# Altium project Motion_Controller.PrjPCB (part 1 of 4)
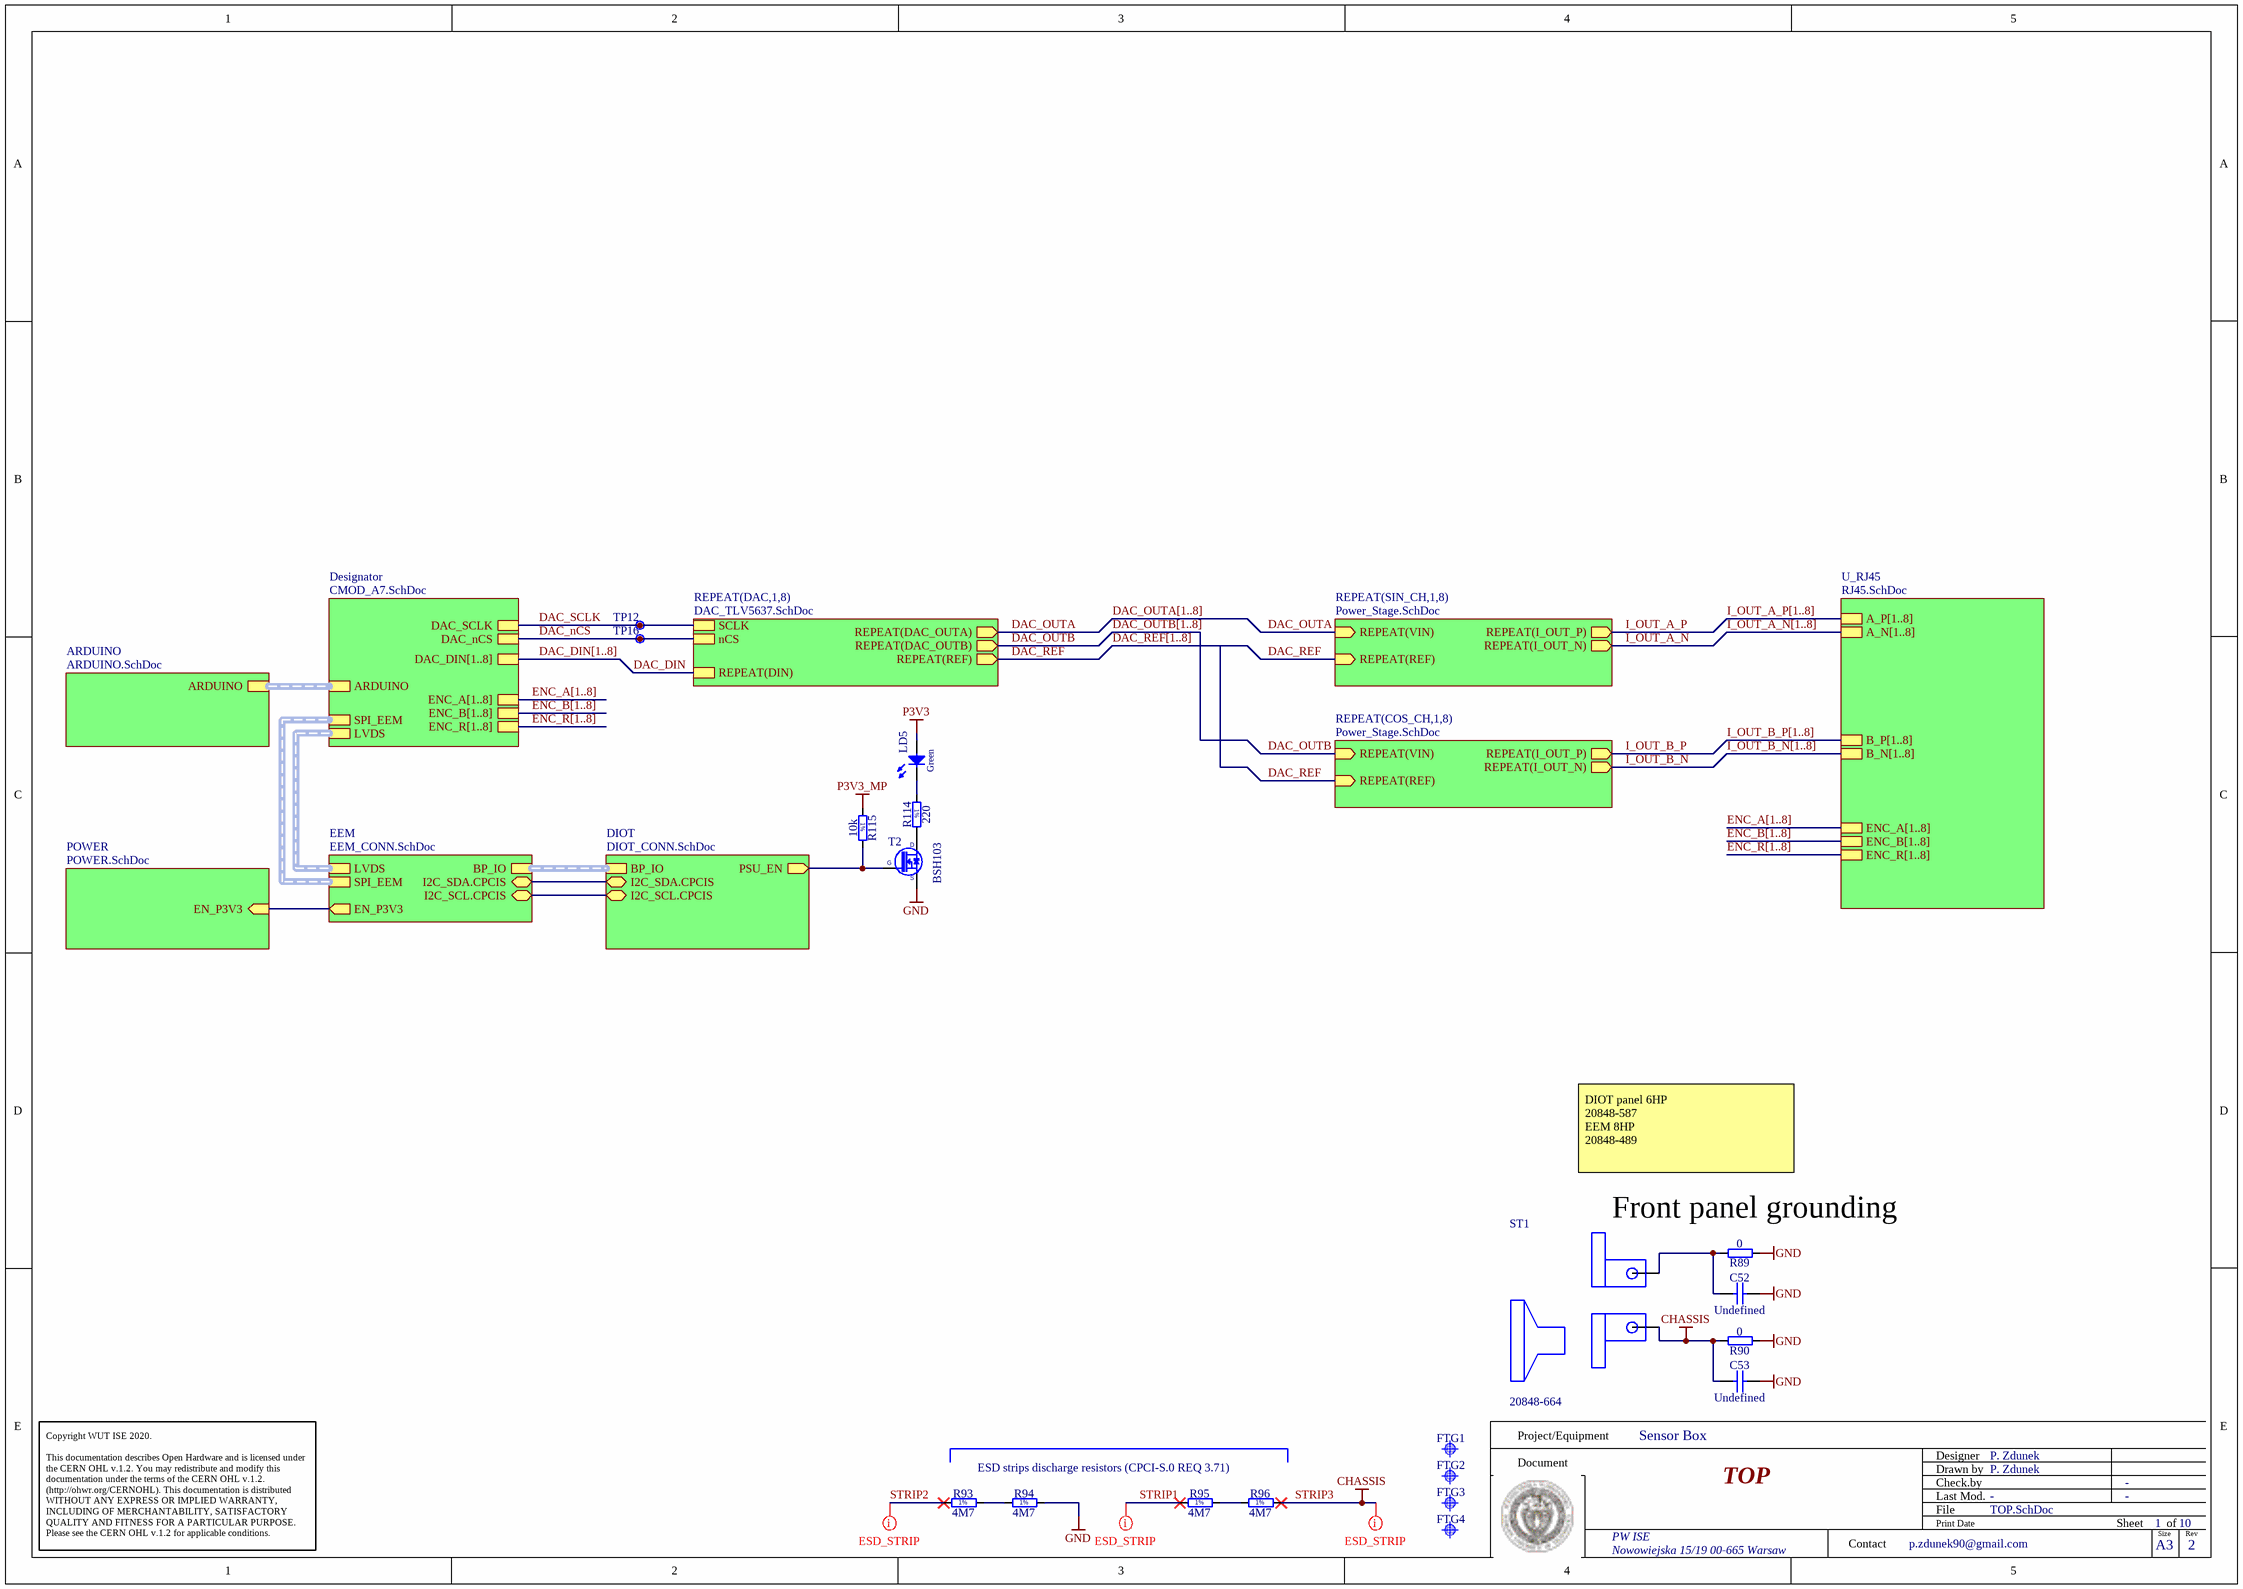
[diagram p0: TOP.SchDoc]
10 sheets, 888 parts. Net scope: hierarchical (ports join the sheet entries above them; power ports are global).
Board file: Motion_Controller.PCBDOC
Sheets:
  TOP.SchDoc
    DAC1 = DAC_TLV5637.SchDoc
    DAC2 = DAC_TLV5637.SchDoc
    DAC3 = DAC_TLV5637.SchDoc
    DAC4 = DAC_TLV5637.SchDoc
    DAC5 = DAC_TLV5637.SchDoc
    DAC6 = DAC_TLV5637.SchDoc
    DAC7 = DAC_TLV5637.SchDoc
    DAC8 = DAC_TLV5637.SchDoc
    Designator = CMOD_A7.SchDoc
    ARDUINO = ARDUINO.SchDoc
    EEM = EEM_CONN.SchDoc
    DIOT = DIOT_CONN.SchDoc
    POWER = POWER.SchDoc
    U_RJ45 = RJ45.SchDoc
      ENC1 = ENCODER.SchDoc
      ENC2 = ENCODER.SchDoc
      ENC3 = ENCODER.SchDoc
      ENC4 = ENCODER.SchDoc
      ENC5 = ENCODER.SchDoc
      ENC6 = ENCODER.SchDoc
      ENC7 = ENCODER.SchDoc
      ENC8 = ENCODER.SchDoc
    SIN_CH1 = POWER_STAGE.SchDoc
    SIN_CH2 = POWER_STAGE.SchDoc
    SIN_CH3 = POWER_STAGE.SchDoc
    SIN_CH4 = POWER_STAGE.SchDoc
    SIN_CH5 = POWER_STAGE.SchDoc
    SIN_CH6 = POWER_STAGE.SchDoc
    SIN_CH7 = POWER_STAGE.SchDoc
    SIN_CH8 = POWER_STAGE.SchDoc
    COS_CH1 = POWER_STAGE.SchDoc
    COS_CH2 = POWER_STAGE.SchDoc
    COS_CH3 = POWER_STAGE.SchDoc
    COS_CH4 = POWER_STAGE.SchDoc
    COS_CH5 = POWER_STAGE.SchDoc
    COS_CH6 = POWER_STAGE.SchDoc
    COS_CH7 = POWER_STAGE.SchDoc
    COS_CH8 = POWER_STAGE.SchDoc

## Sheet TOP.SchDoc: TOP
size 420 x 297 mm; Author: P. Zdunek; CompanyName: WUT ISE; DrawnBy: P. Zdunek; Organization: WUT ISE; Address1: PW ISE; Address2: Nowowiejska 15/19 00-665 Warsaw; Address3: p.zdunek90@gmail.com; DocumentNumber: 1; Revision: 2; SheetNumber: 1; SheetTotal: 10; ModifiedBy: -; CheckedDate: -; DivGrp: WUT ISE; Designer: P. Zdunek; ModifiedDate: -; ProjectName: Sensor Box

### Parts
C52  Undefined  [CAPC2012X135N]
C53  Undefined  [CAPC2012X135N]
FTG1  Use only in PCB  [FIDUCIAL_TOP_C100-200]  (value not drawn)  (no BOM)
FTG2  Use only in PCB  [FIDUCIAL_TOP_S100-200]  (value not drawn)  (no BOM)
FTG3  Use only in PCB  [FIDUCIAL_TOP_S100-200]  (value not drawn)  (no BOM)
FTG4  Use only in PCB  [FIDUCIAL_TOP_S100-200]  (value not drawn)  (no BOM)
LD5  Green  [LED_DIALIGHT_555-230]
R89  0  [RESC1005X40N]
R90  0  [RESC1005X40N]
R93  4M7  [RESC2113X55N]
R94  4M7  [RESC2113X55N]
R95  4M7  [RESC2113X55N]
R96  4M7  [RESC2113X55N]
R114  220  [RESC1608X55N]
R115  10k  [RESC1005X40N]
ST1  Manufacturer Part Number 2: 20848-664  [SCHROFF_PANEL_3HP_4U]  (no BOM)
T2  BSH103  [SOT95P230X110-3N]
TP12  Plated Hole  [c130h60]  (value not drawn)  (no BOM)
TP16  Plated Hole  [c130h60]  (value not drawn)  (no BOM)

### Sub-sheets
ARDUINO = ARDUINO.SchDoc: ARDUINO (harness Harness)
Designator = CMOD_A7.SchDoc: DAC_DIN[1..8], ENC_A[1..8], ENC_B[1..8], ENC_R[1..8], DAC_SCLK, DAC_nCS, ARDUINO (harness Harness), SPI_EEM (harness Harness), LVDS (harness Harness)
DIOT = DIOT_CONN.SchDoc: BP_IO (harness BP_Conn), I2C_SDA.CPCIS (bidir), I2C_SCL.CPCIS (bidir), PSU_EN (out)
EEM = EEM_CONN.SchDoc: I2C_SDA.CPCIS (bidir), I2C_SCL.CPCIS (bidir), BP_IO (harness BP_Conn), SPI_EEM (harness Harness), LVDS (harness Harness), EN_P3V3 (out)
POWER = POWER.SchDoc: EN_P3V3 (in)
REPEAT(COS_CH,1,8) = Power_Stage.SchDoc: REPEAT(I_OUT_P) (out), REPEAT(I_OUT_N) (out), REPEAT(VIN) (in), REPEAT(REF) (in)
REPEAT(DAC,1,8) = DAC_TLV5637.SchDoc: SCLK, REPEAT(DIN), nCS, REPEAT(DAC_OUTA) (out), REPEAT(DAC_OUTB) (out), REPEAT(REF) (out)
REPEAT(SIN_CH,1,8) = Power_Stage.SchDoc: REPEAT(I_OUT_P) (out), REPEAT(I_OUT_N) (out), REPEAT(VIN) (in), REPEAT(REF) (in)
U_RJ45 = RJ45.SchDoc: A_P[1..8], A_N[1..8], B_P[1..8], B_N[1..8], ENC_B[1..8], ENC_R[1..8], ENC_A[1..8]

### Nets
CHASSIS: C53.1 R90.2 R96.2 ST1.0  [also labelled STRIP3]
GND: C52.2 C53.2 R89.1 R90.1 R94.2 T2.2(S)
P3V3: LD5.2(A)
P3V3_MP: R115.1
DAC_DIN: sheet REPEAT(DAC,1,8)/REPEAT(DIN)
DAC_nCS: TP16.1 ; sheet REPEAT(DAC,1,8)/nCS, sheet Designator/DAC_nCS
DAC_OUTA: sheet REPEAT(DAC,1,8)/REPEAT(DAC_OUTA), sheet REPEAT(SIN_CH,1,8)/REPEAT(VIN)
DAC_OUTB: sheet REPEAT(DAC,1,8)/REPEAT(DAC_OUTB), sheet REPEAT(COS_CH,1,8)/REPEAT(VIN)
DAC_REF: sheet REPEAT(DAC,1,8)/REPEAT(REF), sheet REPEAT(SIN_CH,1,8)/REPEAT(REF), sheet REPEAT(COS_CH,1,8)/REPEAT(REF)
DAC_SCLK: TP12.1 ; sheet REPEAT(DAC,1,8)/SCLK, sheet Designator/DAC_SCLK
EN_P3V3: sheet EEM/EN_P3V3, sheet POWER/EN_P3V3
I2C_SCL.CPCIS: sheet EEM/I2C_SCL.CPCIS, sheet DIOT/I2C_SCL.CPCIS
I2C_SDA.CPCIS: sheet EEM/I2C_SDA.CPCIS, sheet DIOT/I2C_SDA.CPCIS
I_OUT_A_N: sheet REPEAT(SIN_CH,1,8)/REPEAT(I_OUT_N)
I_OUT_A_P: sheet REPEAT(SIN_CH,1,8)/REPEAT(I_OUT_P)
I_OUT_B_N: sheet REPEAT(COS_CH,1,8)/REPEAT(I_OUT_N)
I_OUT_B_P: sheet REPEAT(COS_CH,1,8)/REPEAT(I_OUT_P)
PSU_EN: R115.2 T2.1(G) ; sheet DIOT/PSU_EN
STRIP1: R95.1
STRIP2: R93.1
NetC52_1: C52.1 R89.2 ST1.1
NetLD5_1: LD5.1(C) R114.1
NetR93_2: R93.2 R94.1
NetR95_2: R95.2 R96.1
NetR114_2: R114.2 T2.3(D)

### Buses and harness runs
bus DAC_DIN[1..8] = sheet Designator/DAC_DIN[1..8]
bus DAC_OUTA[1..8]
bus DAC_OUTB[1..8]
bus DAC_REF[1..8]
bus ENC_A[1..8] = sheet Designator/ENC_A[1..8]
bus ENC_A[1..8] = sheet U_RJ45/ENC_A[1..8]
bus ENC_B[1..8] = sheet Designator/ENC_B[1..8]
bus ENC_B[1..8] = sheet U_RJ45/ENC_B[1..8]
bus ENC_R[1..8] = sheet Designator/ENC_R[1..8]
bus ENC_R[1..8] = sheet U_RJ45/ENC_R[1..8]
bus I_OUT_A_N[1..8] = sheet U_RJ45/A_N[1..8]
bus I_OUT_A_P[1..8] = sheet U_RJ45/A_P[1..8]
bus I_OUT_B_N[1..8] = sheet U_RJ45/B_N[1..8]
bus I_OUT_B_P[1..8] = sheet U_RJ45/B_P[1..8]
harness sheet ARDUINO/ARDUINO = sheet Designator/ARDUINO
harness sheet Designator/LVDS = sheet EEM/LVDS
harness sheet Designator/SPI_EEM = sheet EEM/SPI_EEM
harness sheet DIOT/BP_IO = sheet EEM/BP_IO

### Layout directives
net class ESD_STRIP: CHASSIS, STRIP1, STRIP2

### Notes on the sheet
- DIOT panel 6HP
  20848-587
  EEM 8HP
  20848-489
- (near R89) Front panel grounding
- ESD strips discharge resistors (CPCI-S.0 REQ 3.71)
- Project/Equipment
- Document
- Designer
- Drawn by
- Check.by
- Copyright WUT ISE 2020.
  This documentation describes Open Hardware and is licensed under the CERN OHL v.1.2. You may redistribute and modify this documentation under the terms of the CERN OHL v.1.2. (http://ohwr.org/CERNOHL). This documentation is distributed WITHOUT ANY EXPRESS OR IMPLIED WARRANTY, INCLUDING OF MERCHANTABILITY, SATISFACTORY QUALITY AND FITNESS FOR A PARTICULAR PURPOSE. Please see the CERN OHL v.1.2 for applicable conditions.
- Contact
- File
- Last Mod.
- Print Date
- Sheet
- Size
- A3
- of
- Rev
- (in symbol R0402_10K_1%_0.0625W_100PPM) 1%
- (in symbol R0603_220R_1%_0.1W_100PPM) 1%
- (in symbol R0805_4M7_1%_0.125W_100PPM_VISHAY_CRCW e3) 1%

### Library data of the parts
C52 C53 = CC0805_NO-VALUE: Non-polarised capacitor; Part Description: Reserved Footprint For 0805(2012) Chip Ceramic Capacitor; Mounted: No; Part Number: CC0805_NO-VALUE; Component Kind: Standard; Component Type: Standard; Pin Count: 2; Value: Undefined; Status: None; Manufacturer: Undefined; Manufacturer Part Number: CC0805_NO-VALUE; Case: 0805; Socket: No; SMD: Yes; Sense: No; Manufacturer1 ComponentHeight: 1.35mm; HelpURL: Undefined; Author: CERN DEM JLC; CreateDate: 10.12.2008; LatestRevisionDate: 11.09.2013
FTG1 = FIDUCIAL_TARGET_C100-200: Fiducial Target; Part Description: Round Fiducial Target, Top Layer, 1.0mm, Top Solder 2.0mm, Keepout =2.0mm; Mounted: No; Part Number: FIDUCIAL_TARGET_C100-200; Component Type: Standard (No BOM); Pin Count: 1; Family: Fiducial; Socket: No; SMD: Yes; Sense: No; Status: None; ComponentHeight: 0mm; HelpURL: Undefined; Author: CERN DEM JLC; CreateDate: 09.02.2010; LatestRevisionDate: 04.04.2012; PackageDescription: Round Fiducial Target, Top Layer, 1.0mm, Top Solder 2.0mm, Keepout =2.0mm
FTG2-FTG4 = FIDUCIAL_TARGET_S100-200: Fiducial Target; Part Description: Square Fiducial Target, Top Layer, 1.0mm, Top Solder 2.0mm, Keepout =2.0mm; Mounted: No; Part Number: FIDUCIAL_TARGET_S100-200; Component Type: Standard (No BOM); Pin Count: 1; Family: Fiducial; Socket: No; SMD: Yes; Sense: No; Status: None; ComponentHeight: 0mm; HelpURL: Undefined; Author: CERN DEM JLC; CreateDate: 09.02.2010; LatestRevisionDate: 04.04.2012; PackageDescription: Square Fiducial Target, Top Layer, 1.0mm, Top Solder 2.0mm, Keepout =2.0mm
LD5 = LED_DIALIGHT_555-2301F: LED Green 1C 2A; Part Description: Single 2mm Green LED CBI® Circuit Board Indicator; PressFit: No; Bonding: No; Part Number: LED_DIALIGHT_555-2301F; Component Kind: Standard; Component Type: Standard; Color: Green; PackageDescription: Single 2mm Green LED, Body 5.08x2.54mm, Pin spacing 2.54mm; Manufacturer: DIALIGHT; Manufacturer Part Number: 555-2301F; Pin Count: 2; Mounted: Yes; Socket: No; SMD: No; Sense: No; ComponentHeight: 6.35mm; HelpURL: \\cern.ch\dfs\Applications\Altium\Datasheets\LED_DIALIGHT_555-2301F.pdf; Author: CERN DEM JMW; CreateDate: 22.09.2008; LatestRevisionDate: 17.03.2010
R89 R90 = R0402_0R_JUMPER: Resistor; Part Description: 1A (0.05R Max DC Resistance) Zero Ohm Jumper; Manufacturer: GENERIC; Manufacturer1 Part Number: 232270591001L; PressFit: No; Part Number: R0402_0R_JUMPER; Component Kind: Standard; Component Type: Standard; Pin Count: 2; Value: 0; Status: Not Recommended; Manufacturer Part Number: R0402_0R_JUMPER; Case: 0402; Mounted: Yes; Sense: No; Socket: No; SMD: Yes; Manufacturer1 Example: YAGEO PHYCOMP; Manufacturer1 ComponentHeight: 0.4mm; HelpURL: \\cern.ch\dfs\Applications\Altium\Datasheets\R0402_Phycomp_RC0402.pdf; Author: CERN DEM JLC; CreateDate: 03/12/2007; LatestRevisionDate: 17/10/2012
R93-R96 = R0805_4M7_1%_0.125W_100PPM_VISHAY_CRCW e3: Resistor - 1%; Part Description: 150V, Standard Thick Film Chip Resistor; Manufacturer: VISHAY; Manufacturer Part Number: CRCW08054M70FKEA; Power: 0.125W; TC: ±100ppm/°C; PressFit: No; Part Number: R0805_4M7_1%_0.125W_100PPM_VISHAY_CRCW e3; Component Kind: Standard; Component Type: Standard; Pin Count: 2; Value: 4M7; Status: None; Tolerance: ±1%; Case: 0805; Mounted: Yes; Sense: No; Socket: No; SMD: Yes; ComponentHeight: 0.5mm; HelpURL: \\cern.ch\dfs\Applications\Altium\Datasheets\R0805_VISHAY_CRCW e3.pdf; Author: CERN DEM BR; CreateDate: 27/05/2019; LatestRevisionDate: 27/05/2019
R114 = R0603_220R_1%_0.1W_100PPM: Resistor - 1%; Part Description: General Purpose Thick Film Chip Resistor; Manufacturer: GENERIC; Manufacturer1 Part Number: NRC06F2200TRF; Power: 0.1W; TC: ±100ppm/°C; Part Number: R0603_220R_1%_0.1W_100PPM; Component Kind: Standard; Component Type: Standard; Pin Count: 2; Value: 220; Status: Preferred; Tolerance: ±1%; Manufacturer Part Number: R0603_220R_1%_0.1W_100PPM; Case: 0603; Mounted: Yes; Sense: No; Socket: No; SMD: Yes; Manufacturer1 Example: NIC COMPONENT; Manufacturer1 ComponentHeight: 0.55mm; HelpURL: \\cern.ch\dfs\Applications\Altium\Datasheets\R0603_NIC_NRC.pdf; Author: CERN DEM JLC; CreateDate: 03.12.2007; LatestRevisionDate: 13.03.2008
R115 = R0402_10K_1%_0.0625W_100PPM: Resistor - 1%; Part Description: General Purpose Thick Film Chip Resistor; Manufacturer: GENERIC; Manufacturer1 Part Number: 232270671003L; TC: ±100ppm/°C; PressFit: No; Part Number: R0402_10K_1%_0.0625W_100PPM; Component Kind: Standard; Component Type: Standard; Pin Count: 2; Value: 10k; Status: Not Recommended; Power: 0.0625W; Tolerance: ±1%; Manufacturer Part Number: R0402_10K_1%_0.0625W_100PPM; Case: 0402; Mounted: Yes; Sense: No; Socket: No; SMD: Yes; Manufacturer1 Example: YAGEO PHYCOMP; Manufacturer1 ComponentHeight: 0.4mm; HelpURL: \\cern.ch\dfs\Applications\Altium\Datasheets\R0402_Phycomp_RC0402.pdf; Author: CERN DEM JLC; CreateDate: 03.12.2007; LatestRevisionDate: 17.10.2012
ST1 = SCHROFF_PANEL_3U_4HP: Schroff 3HP 4U EUROCARD Panel Kit; Manufacturer Part Number: 20818-017; Manufacturer: Schroff
T2 = BSH103: N-CHANNEL MOSFET WITH DIODE; Part Description: 30V 850mA N-Channel Enhancement Mode Field-Effect Transistor; Manufacturer: NEXPERIA; PressFit: No; Bonding: No; Part Number: BSH103; Component Kind: Standard; Component Type: Standard; Device: BSH103; PackageDescription: SOT23, 0.95mm Pitch; 3 Pin, 1.30mm W X 2.90mm L X 1.10mm H body, IPC Medium Density; Manufacturer Part Number: BSH103; Pin Count: 3; Case: SOT23-3; Mounted: Yes; Socket: No; SMD: Yes; Sense: No; ComponentHeight: 1.1mm; HelpURL: \\cern.ch\dfs\Applications\Altium\Datasheets\BSH103.pdf; Author: CERN DEM JLC; CreateDate: 16.03.2010; LatestRevisionDate: 20.06.2017
TP12 TP16 = PLATED_HOLE0.6_PAD1.3: Single Terminal Socket; Part Description: Plated Through Hole: Hole Dia.=0.6mm Pad Dia.=1.3mm; Mounted: No; Part Number: PLATED_HOLE0.6_PAD1.3; Component Type: Standard (No BOM); Pin Count: 1; Family: Plated Hole; Socket: No; SMD: No; Sense: No; Status: None; ComponentHeight: 0mm; HelpURL: Undefined; Author: CERN DEM MR; CreateDate: 02/03/2016; LatestRevisionDate: 02/03/2016; PackageDescription: Plated Through Hole: Hole Dia.=0.6mm Pad Dia.=1.3mm

## Sheet DAC_TLV5637.SchDoc: DAC
size 420 x 297 mm; Author: P. Zdunek; CompanyName: WUT ISE; DrawnBy: P. Zdunek; Organization: WUT ISE; Address1: PW ISE; Address2: Nowowiejska 15/19 00-665 Warsaw; Address3: p.zdunek90@gmail.com; DocumentNumber: 4; Revision: 2; SheetNumber: 4; SheetTotal: 10; ModifiedBy: -; CheckedDate: -; Title2: TLV5637; DivGrp: WUT ISE; Designer: P. Zdunek; ModifiedDate: -; ProjectName: Sensor Box
Used 8 times, as channels DAC1, DAC2, DAC3, DAC4, DAC5, DAC6, DAC7, DAC8. Parts and nets are listed once, with the designators drawn on the sheet.
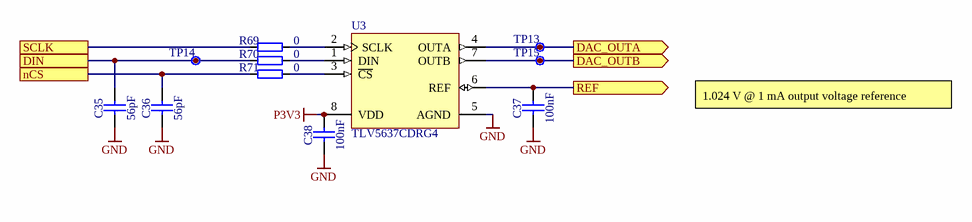
[diagram p1: DAC_TLV5637.SchDoc]

### Parts
C35  56pF  [CAPC1005X55N]
C36  56pF  [CAPC1005X55N]
C37  100nF  [CAPC1005X55N]
C38  100nF  [CAPC1005X55N]
R69  0  [RESC1005X40N]
R70  0  [RESC1005X40N]
R71  0  [RESC1005X40N]
TP13  Plated Hole  [c130h60]  (value not drawn)  (no BOM)
TP14  Plated Hole  [c130h60]  (value not drawn)  (no BOM)
TP15  Plated Hole  [c130h60]  (value not drawn)  (no BOM)
U3  TLV5637CDRG4  [TI-D8_N]

### Ports
DAC_OUTA (out), DAC_OUTB (out), DIN, nCS, REF (out), SCLK

### Nets
GND: C35.1 C36.1 C37.1 C38.1 U3.5(AGND)
P3V3: C38.2 U3.8(VDD)
DAC_OUTA: TP13.1 U3.4(OUTA) ; port DAC_OUTA
DAC_OUTB: TP15.1 U3.7(OUTB) ; port DAC_OUTB
DIN: C35.2 R70.1 TP14.1 ; port DIN
nCS: C36.2 R71.1 ; port nCS
REF: C37.2 U3.6(REF) ; port REF
SCLK: R69.1 ; port SCLK
NetR69_2: R69.2 U3.2(SCLK)
NetR70_2: R70.2 U3.1(DIN)
NetR71_2: R71.2 U3.3(~{CS})

### Channels
DAC1: designators end in A; ports DAC_OUTA=DAC_OUTA1 DAC_OUTB=DAC_OUTB1 DIN=DAC_DIN1 nCS=DAC_nCS REF=DAC_REF1 SCLK=DAC_SCLK
DAC2: designators end in B; ports DAC_OUTA=DAC_OUTA2 DAC_OUTB=DAC_OUTB2 DIN=DAC_DIN2 nCS=DAC_nCS REF=DAC_REF2 SCLK=DAC_SCLK
DAC3: designators end in C; ports DAC_OUTA=DAC_OUTA3 DAC_OUTB=DAC_OUTB3 DIN=DAC_DIN3 nCS=DAC_nCS REF=DAC_REF3 SCLK=DAC_SCLK
DAC4: designators end in D; ports DAC_OUTA=DAC_OUTA4 DAC_OUTB=DAC_OUTB4 DIN=DAC_DIN4 nCS=DAC_nCS REF=DAC_REF4 SCLK=DAC_SCLK
DAC5: designators end in E; ports DAC_OUTA=DAC_OUTA5 DAC_OUTB=DAC_OUTB5 DIN=DAC_DIN5 nCS=DAC_nCS REF=DAC_REF5 SCLK=DAC_SCLK
DAC6: designators end in F; ports DAC_OUTA=DAC_OUTA6 DAC_OUTB=DAC_OUTB6 DIN=DAC_DIN6 nCS=DAC_nCS REF=DAC_REF6 SCLK=DAC_SCLK
DAC7: designators end in G; ports DAC_OUTA=DAC_OUTA7 DAC_OUTB=DAC_OUTB7 DIN=DAC_DIN7 nCS=DAC_nCS REF=DAC_REF7 SCLK=DAC_SCLK
DAC8: designators end in H; ports DAC_OUTA=DAC_OUTA8 DAC_OUTB=DAC_OUTB8 DIN=DAC_DIN8 nCS=DAC_nCS REF=DAC_REF8 SCLK=DAC_SCLK

### Notes on the sheet
- 1.024 V @ 1 mA output voltage reference
- Project/Equipment
- Document
- Designer
- Drawn by
- Check.by
- Copyright WUT ISE 2020.
  This documentation describes Open Hardware and is licensed under the CERN OHL v.1.2. You may redistribute and modify this documentation under the terms of the CERN OHL v.1.2. (http://ohwr.org/CERNOHL). This documentation is distributed WITHOUT ANY EXPRESS OR IMPLIED WARRANTY, INCLUDING OF MERCHANTABILITY, SATISFACTORY QUALITY AND FITNESS FOR A PARTICULAR PURPOSE. Please see the CERN OHL v.1.2 for applicable conditions.
- Contact
- File
- Last Mod.
- Print Date
- Sheet
- Size
- A3
- of
- Rev

### Library data of the parts
C35 C36 = CC0402_56PF_50V_5%_C0G: Non-polarised capacitor; Part Description: SMD Multilayer Chip Ceramic Capacitor; Manufacturer: GENERIC; Manufacturer1 Part Number: C0402C560J5GACTU; Voltage: 50V; TC: C0G/NP0; Tolerance: ±5%; Part Number: CC0402_56PF_50V_5%_C0G; Component Kind: Standard; Component Type: Standard; Pin Count: 2; Value: 56pF; Status: Preferred; Manufacturer Part Number: CC0402_56PF_50V_5%_C0G; Case: 0402; Mounted: Yes; Socket: No; SMD: Yes; Sense: No; Manufacturer1 Example: KEMET; Manufacturer1 ComponentHeight: 0.55mm; HelpURL: \\cern.ch\dfs\Applications\Altium\Datasheets\CC0402_C0G_KEMET_(Commercial Grade).pdf; Author: CERN DEM JLC; CreateDate: 16/11/2017; LatestRevisionDate: 16/11/2017
C37 C38 = CC0402_100NF_16V_10%_X5R: Non-polarised capacitor; Part Description: SMD Multilayer Chip Ceramic Capacitor; Manufacturer: GENERIC; Manufacturer1 Part Number: GRM155R61C104KA88D; Voltage: 16V; TC: X5R; Tolerance: ±10%; Part Number: CC0402_100NF_16V_10%_X5R; Component Kind: Standard; Component Type: Standard; Pin Count: 2; Value: 100nF; Status: None; Manufacturer Part Number: CC0402_100NF_16V_10%_X5R; Case: 0402; Mounted: Yes; Socket: No; SMD: Yes; Sense: No; Manufacturer1 Example: MURATA; Manufacturer1 ComponentHeight: 0.55mm; HelpURL: \\cern.ch\dfs\Applications\Altium\Datasheets\CC0402_X5R_MURATA_GRM.pdf; Author: CERN DEM JLC; CreateDate: 10.12.2013; LatestRevisionDate: 10.12.2013
R69-R71 = R0402_0R_JUMPER: as R89 on sheet TOP; Part Number: R0402_0R_JUMPER; Component Kind: Standard; Component Type: Standard; Pin Count: 2; Value: 0; Status: Not Recommended; Manufacturer Part Number: R0402_0R_JUMPER; Case: 0402; Mounted: Yes; Sense: No; Socket: No; SMD: Yes; Manufacturer1 Example: YAGEO PHYCOMP; Manufacturer1 ComponentHeight: 0.4mm; HelpURL: \\cern.ch\dfs\Applications\Altium\Datasheets\R0402_Phycomp_RC0402.pdf; Author: CERN DEM JLC; CreateDate: 03.12.2007; LatestRevisionDate: 17.10.2012
TP13-TP15 = PLATED_HOLE0.6_PAD1.3: as TP12 on sheet TOP; Part Number: PLATED_HOLE0.6_PAD1.3; Component Type: Standard (No BOM); Pin Count: 1; Family: Plated Hole; Socket: No; SMD: No; Sense: No; Status: None; ComponentHeight: 0mm; HelpURL: Undefined; Author: CERN DEM MR; CreateDate: 02/03/2016; LatestRevisionDate: 02/03/2016; PackageDescription: Plated Through Hole: Hole Dia.=0.6mm Pad Dia.=1.3mm
U3 = CMP-0004-00184-1: 10-Bit, 1 us DAC Serial Input, Dual DAC, Programmable Internal Reference, Settling Time, 0 to 70 degC, 8-pin SOIC (D8), Green (RoHS & no Sb/Br); Manufacturer: Texas Instruments; INL(Max)(+/-LSB): 1; SubFamily: Precision DAC (=<10MSPS); Interface: Serial SPI; Power Consumption(Typ)(mW): 4.2; SNR(dB): 56; DNL(Max)(+/-LSB): 0.5; SFDR(dB): 62; DAC Channels: 2; Resolution(Bits): 10; Settling Time(us): 0.8; Eco-Plan: Green (RoHS & no Sb/Br); Mounting Technology: Surface Mount; DatasheetVersion: SLAS224C; ComponentLink2Description: Datasheet; PackageDescription: 8-Pin Plastic Small Outline, Body 4.9 x 3.9 mm, Pitch 1.27 mm; PartNumber: TLV5637CDRG4; PackageVersion: 4040047-3/M, 06/2011; ComponentLink3URL: http://www.ti.com/litv/pdf/msoi002j; PackageReference: D8; ComponentLink1URL: http://www.ti.com/; ComponentLink1Description: Manufacturer URL; ComponentLink3Description: Package Specification; ComponentLink2URL: http://www.ti.com/general/docs/lit/getliterature.tsp?genericPartNumber=TLV5637&fileType=pdf; Code_JEDEC: MS-012

## Sheet CMOD_A7.SchDoc: CMOD-A7
size 420 x 297 mm; Author: P. Zdunek; CompanyName: WUT ISE; DrawnBy: P. Zdunek; Organization: WUT ISE; Address1: PW ISE; Address2: Nowowiejska 15/19 00-665 Warsaw; Address3: p.zdunek90@gmail.com; DocumentNumber: 3; Revision: 2; SheetNumber: 3; SheetTotal: 10; ModifiedBy: -; CheckedDate: -; DivGrp: WUT ISE; Designer: P. Zdunek; ModifiedDate: -; ProjectName: Sensor Box
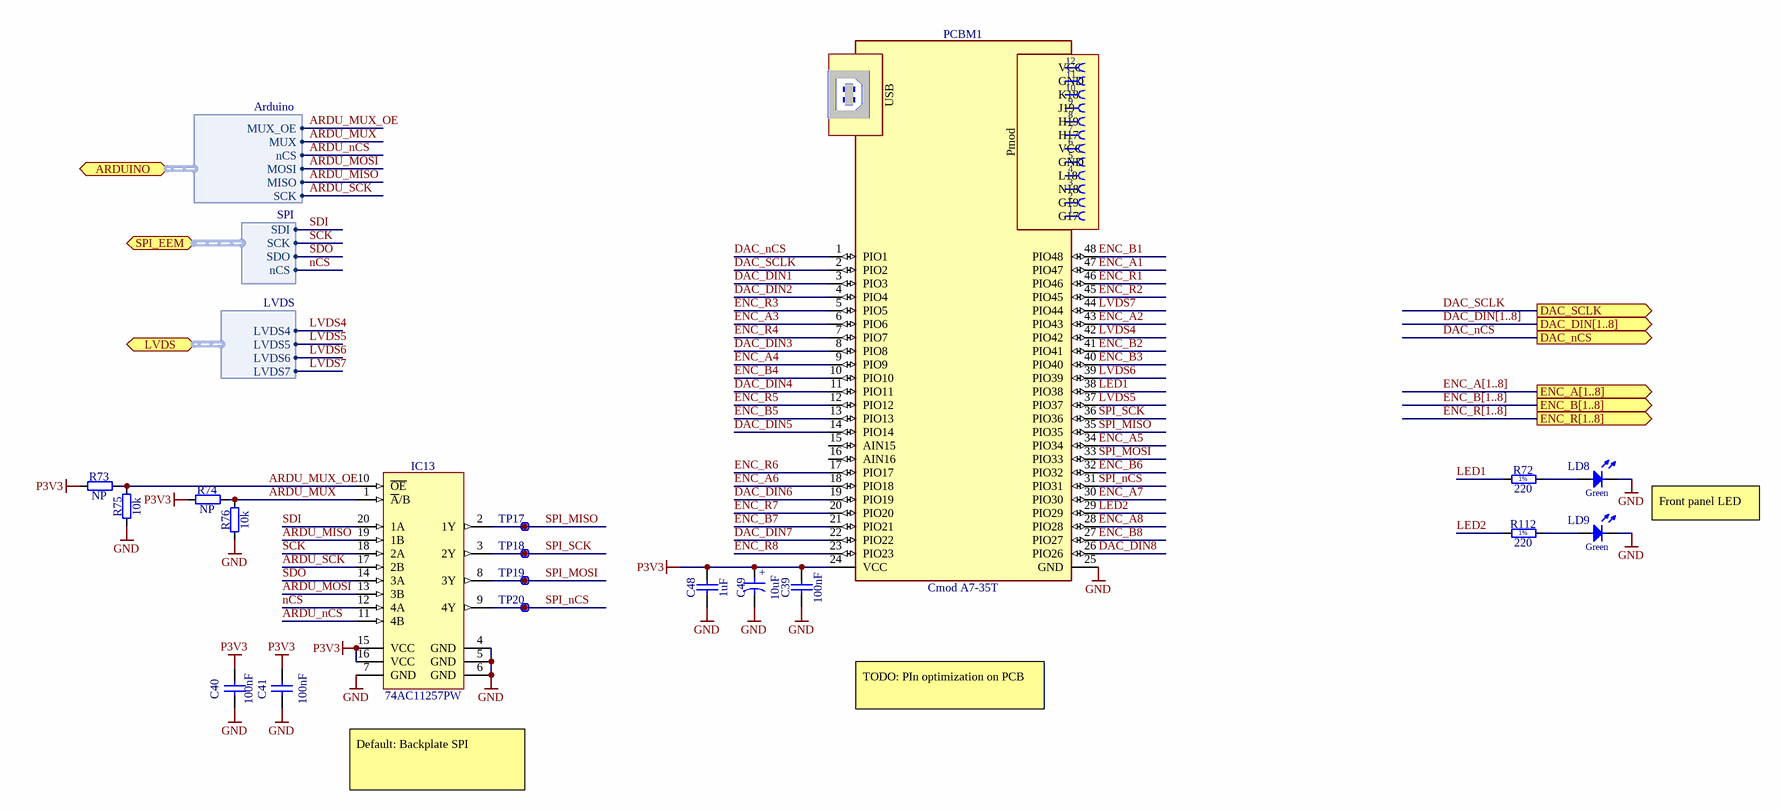
[diagram p2: CMOD_A7.SchDoc]

### Parts
C39  100nF  [CAPC1005X55N]
C40  100nF  [CAPC1005X55N]
C41  100nF  [CAPC1005X55N]
C48  1uF  [CAPC1608X87N]
C49  10uF  [CAPMP3216X180N]
IC13  74AC11257PW  [SOP65P640X120-20N]
LD8  Green  [LED_DIALIGHT_555-230]
LD9  Green  [LED_DIALIGHT_555-230]
PCBM1  Cmod A7-35T  [PCBM_DIGILENT_CMODA7]
R72  220  [RESC1608X55N]
R73  NP  [RESC1005X40N]
R74  NP  [RESC1005X40N]
R75  10k  [RESC1005X40N]
R76  10k  [RESC1005X40N]
R112  220  [RESC1608X55N]
TP17  Plated Hole  [c130h60]  (value not drawn)  (no BOM)
TP18  Plated Hole  [c130h60]  (value not drawn)  (no BOM)
TP19  Plated Hole  [c130h60]  (value not drawn)  (no BOM)
TP20  Plated Hole  [c130h60]  (value not drawn)  (no BOM)

### Ports
ARDUINO (bidir, harness Arduino), DAC_DIN[1..8] (out), DAC_nCS (out), DAC_SCLK (out), ENC_A[1..8] (out), ENC_B[1..8] (out), ENC_R[1..8] (out), LVDS (bidir, harness LVDS), SPI_EEM (bidir, harness SPI)

### Harnesses
Arduino: nCS, MOSI, MISO, SCK, MUX_OE, MUX
SPI: SDI, SCK, SDO, nCS
LVDS: LVDS4, LVDS5, LVDS6, LVDS7

### Nets
GND: C39.1 C40.1 C41.1 C48.1 C49.2 IC13.4(GND) IC13.5(GND) IC13.6(GND) IC13.7(GND) LD8.1(C) LD9.1(C) PCBM1.25(GND) R75.1 R76.1
P3V3: C39.2 C40.2 C41.2 C48.2 C49.1 IC13.15(VCC) IC13.16(VCC) PCBM1.24(VCC) R73.1 R74.1
ARDU_MISO: IC13.19(1B) ; port ARDUINO.MISO
ARDU_MOSI: IC13.13(3B) ; port ARDUINO.MOSI
ARDU_MUX: IC13.1(~{A}/B) R74.2 R76.2 ; port ARDUINO.MUX
ARDU_MUX_OE: IC13.10(~{OE}) R73.2 R75.2 ; port ARDUINO.MUX_OE
ARDU_nCS: IC13.11(4B) ; port ARDUINO.nCS
ARDU_SCK: IC13.17(2B) ; port ARDUINO.SCK
DAC_DIN1: PCBM1.3(PIO3)
DAC_DIN2: PCBM1.4(PIO4)
DAC_DIN3: PCBM1.8(PIO8)
DAC_DIN4: PCBM1.11(PIO11)
DAC_DIN5: PCBM1.14(PIO14)
DAC_DIN6: PCBM1.19(PIO19)
DAC_DIN7: PCBM1.22(PIO22)
DAC_DIN8: PCBM1.26(PIO26)
DAC_nCS: PCBM1.1(PIO1) ; port DAC_nCS
DAC_SCLK: PCBM1.2(PIO2) ; port DAC_SCLK
ENC_A1: PCBM1.47(PIO47)
ENC_A2: PCBM1.43(PIO43)
ENC_A3: PCBM1.6(PIO6)
ENC_A4: PCBM1.9(PIO9)
ENC_A5: PCBM1.34(PIO34)
ENC_A6: PCBM1.18(PIO18)
ENC_A7: PCBM1.30(PIO30)
ENC_A8: PCBM1.28(PIO28)
ENC_B1: PCBM1.48(PIO48)
ENC_B2: PCBM1.41(PIO41)
ENC_B3: PCBM1.40(PIO40)
ENC_B4: PCBM1.10(PIO10)
ENC_B5: PCBM1.13(PIO13)
ENC_B6: PCBM1.32(PIO32)
ENC_B7: PCBM1.21(PIO21)
ENC_B8: PCBM1.27(PIO27)
ENC_R1: PCBM1.46(PIO46)
ENC_R2: PCBM1.45(PIO45)
ENC_R3: PCBM1.5(PIO5)
ENC_R4: PCBM1.7(PIO7)
ENC_R5: PCBM1.12(PIO12)
ENC_R6: PCBM1.17(PIO17)
ENC_R7: PCBM1.20(PIO20)
ENC_R8: PCBM1.23(PIO23)
LED1: PCBM1.38(PIO38) R72.1
LED2: PCBM1.29(PIO29) R112.1
LVDS4: PCBM1.42(PIO42) ; port LVDS.LVDS4
LVDS5: PCBM1.37(PIO37) ; port LVDS.LVDS5
LVDS6: PCBM1.39(PIO39) ; port LVDS.LVDS6
LVDS7: PCBM1.44(PIO44) ; port LVDS.LVDS7
nCS: IC13.12(4A) ; port SPI_EEM.nCS
SCK: IC13.18(2A) ; port SPI_EEM.SCK
SDI: IC13.20(1A) ; port SPI_EEM.SDI
SDO: IC13.14(3A) ; port SPI_EEM.SDO
SPI_MISO: IC13.2(1Y) PCBM1.35(PIO35) TP17.1
SPI_MOSI: IC13.8(3Y) PCBM1.33(PIO33) TP19.1
SPI_nCS: IC13.9(4Y) PCBM1.31(PIO31) TP20.1
SPI_SCK: IC13.3(2Y) PCBM1.36(PIO36) TP18.1
NetLD8_2: LD8.2(A) R72.2
NetLD9_2: LD9.2(A) R112.2

Not connected (* = marked no-connect by the designer): PCBM1 15(AIN15) 16(AIN16)

### Buses and harness runs
bus DAC_DIN[1..8] = port DAC_DIN[1..8]
bus ENC_A[1..8] = port ENC_A[1..8]
bus ENC_B[1..8] = port ENC_B[1..8]
bus ENC_R[1..8] = port ENC_R[1..8]

### Notes on the sheet
- Front panel LED
- TODO: PIn optimization on PCB
- Default: Backplate SPI
- Project/Equipment
- Document
- Designer
- Drawn by
- Check.by
- Copyright WUT ISE 2020.
  This documentation describes Open Hardware and is licensed under the CERN OHL v.1.2. You may redistribute and modify this documentation under the terms of the CERN OHL v.1.2. (http://ohwr.org/CERNOHL). This documentation is distributed WITHOUT ANY EXPRESS OR IMPLIED WARRANTY, INCLUDING OF MERCHANTABILITY, SATISFACTORY QUALITY AND FITNESS FOR A PARTICULAR PURPOSE. Please see the CERN OHL v.1.2 for applicable conditions.
- Contact
- File
- Last Mod.
- Print Date
- Sheet
- Size
- A3
- of
- Rev
- (in symbol CTE3216-18_10UF_16V_20%_AVX_TCJ) +
- (in symbol PCBM_DIGILENT_CMOD A7-35T) USB; K18; J19; H19; H17; Pmod; L18; N18; G19; G17
- (in symbol R0603_220R_1%_0.1W_100PPM) 1%

### Library data of the parts
C39-C41 = CC0402_100NF_16V_10%_X5R: as C37 on sheet DAC_TLV5637; Part Number: CC0402_100NF_16V_10%_X5R; Component Kind: Standard; Component Type: Standard; Pin Count: 2; Value: 100nF; Status: None; Manufacturer Part Number: CC0402_100NF_16V_10%_X5R; Case: 0402; Mounted: Yes; Socket: No; SMD: Yes; Sense: No; Manufacturer1 Example: MURATA; Manufacturer1 ComponentHeight: 0.55mm; HelpURL: \\cern.ch\dfs\Applications\Altium\Datasheets\CC0402_X5R_MURATA_GRM.pdf; Author: CERN DEM JLC
  C39: CreateDate: 10.12.2013; LatestRevisionDate: 10.12.2013
  C40 C41: CreateDate: 10/12/2013; LatestRevisionDate: 10/12/2013
C48 = CC0603_1UF_25V_10%_X7R: Non-polarised capacitor; Part Description: SMD Multilayer Chip Ceramic Capacitor; Manufacturer: GENERIC; Manufacturer1 Part Number: GRM188R71E105KA12D; Voltage: 25V; TC: X7R; Tolerance: ±10%; Part Number: CC0603_1UF_25V_10%_X7R; Component Kind: Standard; Component Type: Standard; Pin Count: 2; Value: 1uF; Status: None; Manufacturer Part Number: CC0603_1UF_25V_10%_X7R; Case: 0603; Mounted: Yes; Socket: No; SMD: Yes; Sense: No; Manufacturer1 Example: MURATA; Manufacturer1 ComponentHeight: 0.9mm; HelpURL: \\cern.ch\dfs\Applications\Altium\Datasheets\CC0603_X7R_MURATA.pdf; Author: CERN DEM JLC; CreateDate: 18.01.2011; LatestRevisionDate: 18.01.2011
C49 = CTE3216-18_10UF_16V_20%_AVX_TCJ: Polarised capacitor; Part Description: ESR 0R200 Tantalum Solid Electrolytic Chip Capacitor with Conductive Polymer Electrode; Manufacturer: AVX; Manufacturer Part Number: TCJA106M016R0200 or  or TR3A106K016C1700; Voltage: 16V; Tolerance: ±20%; Part Number: CTE3216-18_10UF_16V_20%_AVX_TCJ; Component Kind: Standard; Component Type: Standard; Pin Count: 2; Value: 10uF; Status: Preferred; Case: A; Mounted: Yes; Socket: No; SMD: Yes; Sense: No; ComponentHeight: 1.8mm; HelpURL: \\cern.ch\dfs\Applications\Altium\Datasheets\CTE_AVX_TCJ.pdf; Author: CERN DEM JLC; CreateDate: 29.03.2012; LatestRevisionDate: 29.03.2012
IC13 = 74AC11257PW: Quadruple 2-Line to 1-Line Data Selector/Multiplexer With 3-State Outputs; Manufacturer: TEXAS INSTRUMENTS; PressFit: No; Bonding: No; Part Number: 74AC11257PW; Component Kind: Standard; Component Type: Standard; Device: 74AC11257PW; PackageDescription: SOP, 20-Leads, Body 6.5x4.4mm, Pitch 0.65mm, IPC Medium Density; Part Description: Quadruple 2-Line to 1-Line Data Selector/Multiplexer with 3-State Outputs; Manufacturer Part Number: 74AC11257PW; Pin Count: 20; Case: TSSOP20; Mounted: Yes; Socket: No; SMD: Yes; Sense: No; ComponentHeight: 1.2mm; Author: CERN DEM JLC; HelpURL: \\cern.ch\dfs\Applications\Altium\Datasheets\74AC11257PW.pdf; CreateDate: 26/03/2012; LatestRevisionDate: 26/03/2012
LD8 LD9 = LED_DIALIGHT_555-2301F: as LD5 on sheet TOP; Part Number: LED_DIALIGHT_555-2301F; Component Kind: Standard; Component Type: Standard; Color: Green; PackageDescription: Single 2mm Green LED, Body 5.08x2.54mm, Pin spacing 2.54mm; Manufacturer: DIALIGHT; Manufacturer Part Number: 555-2301F; Pin Count: 2; Mounted: Yes; Socket: No; SMD: No; Sense: No; ComponentHeight: 6.35mm; HelpURL: \\cern.ch\dfs\Applications\Altium\Datasheets\LED_DIALIGHT_555-2301F.pdf; Author: CERN DEM JMW; CreateDate: 22.09.2008; LatestRevisionDate: 17.03.2010
PCBM1 = PCBM_DIGILENT_CMOD A7-35T: Breadboardable Artix-7 FPGA Module; PressFit: No; Bonding: No; Part Number: PCBM_DIGILENT_CMOD A7-35T; Component Kind: Standard; Component Type: Standard; Device: Cmod A7-35T; PackageDescription: Breadboardable Artix-7 FPGA Module; Part Description: Breadboardable Artix-7 FPGA Module; Manufacturer: DIGILENT; Manufacturer Part Number: Cmod A7-35T; Pin Count: 48; Mounted: Yes; Socket: No; SMD: No; Sense: No; ComponentHeight: 12.55mm; Author: CERN DEM BC; HelpURL: \\cern.ch\dfs\Applications\Altium\Datasheets\PCBM_DIGILENT_CMODA7.pdf; CreateDate: 07/02/2019; LatestRevisionDate: 06/02/2023
R72 R112 = R0603_220R_1%_0.1W_100PPM: as R114 on sheet TOP; Part Number: R0603_220R_1%_0.1W_100PPM; Component Kind: Standard; Component Type: Standard; Pin Count: 2; Value: 220; Status: Preferred; Tolerance: ±1%; Manufacturer Part Number: R0603_220R_1%_0.1W_100PPM; Case: 0603; Mounted: Yes; Sense: No; Socket: No; SMD: Yes; Manufacturer1 Example: NIC COMPONENT; Manufacturer1 ComponentHeight: 0.55mm; HelpURL: \\cern.ch\dfs\Applications\Altium\Datasheets\R0603_NIC_NRC.pdf; Author: CERN DEM JLC; CreateDate: 03.12.2007; LatestRevisionDate: 13.03.2008
R73 R74 = R0402_10K_1%_0.0625W_100PPM: Resistor - 1%; Part Description: General Purpose Thick Film Chip Resistor; Manufacturer: GENERIC; Manufacturer1 Part Number: 232270671003L; Value: 10k; TC: ±100ppm/°C; PressFit: No; Part Number: R0402_10K_1%_0.0625W_100PPM; Component Kind: Standard; Component Type: Standard; Pin Count: 2; Status: Not Recommended; Power: 0.0625W; Tolerance: ±1%; Manufacturer Part Number: R0402_10K_1%_0.0625W_100PPM; Case: 0402; Mounted: Yes; Sense: No; Socket: No; SMD: Yes; Manufacturer1 Example: YAGEO PHYCOMP; Manufacturer1 ComponentHeight: 0.4mm; HelpURL: \\cern.ch\dfs\Applications\Altium\Datasheets\R0402_Phycomp_RC0402.pdf; Author: CERN DEM JLC; CreateDate: 03/12/2007; LatestRevisionDate: 17/10/2012
R75 R76 = R0402_10K_1%_0.0625W_100PPM: as R115 on sheet TOP; Part Number: R0402_10K_1%_0.0625W_100PPM; Component Kind: Standard; Component Type: Standard; Pin Count: 2; Value: 10k; Status: Not Recommended; Power: 0.0625W; Tolerance: ±1%; Manufacturer Part Number: R0402_10K_1%_0.0625W_100PPM; Case: 0402; Mounted: Yes; Sense: No; Socket: No; SMD: Yes; Manufacturer1 Example: YAGEO PHYCOMP; Manufacturer1 ComponentHeight: 0.4mm; HelpURL: \\cern.ch\dfs\Applications\Altium\Datasheets\R0402_Phycomp_RC0402.pdf; Author: CERN DEM JLC; CreateDate: 03/12/2007; LatestRevisionDate: 17/10/2012
TP17-TP20 = PLATED_HOLE0.6_PAD1.3: as TP12 on sheet TOP; Part Number: PLATED_HOLE0.6_PAD1.3; Component Type: Standard (No BOM); Pin Count: 1; Family: Plated Hole; Socket: No; SMD: No; Sense: No; Status: None; ComponentHeight: 0mm; HelpURL: Undefined; Author: CERN DEM MR; CreateDate: 02/03/2016; LatestRevisionDate: 02/03/2016; PackageDescription: Plated Through Hole: Hole Dia.=0.6mm Pad Dia.=1.3mm

## Sheet ARDUINO.SchDoc: Arduino
size 420 x 297 mm; Author: P. Zdunek; CompanyName: WUT ISE; DrawnBy: P. Zdunek; Organization: WUT ISE; Address1: PW ISE; Address2: Nowowiejska 15/19 00-665 Warsaw; Address3: p.zdunek90@gmail.com; DocumentNumber: 2; Revision: 2; SheetNumber: 2; SheetTotal: 10; ModifiedBy: -; CheckedDate: -; DivGrp: WUT ISE; Designer: P. Zdunek; ModifiedDate: -; ProjectName: Sensor Box
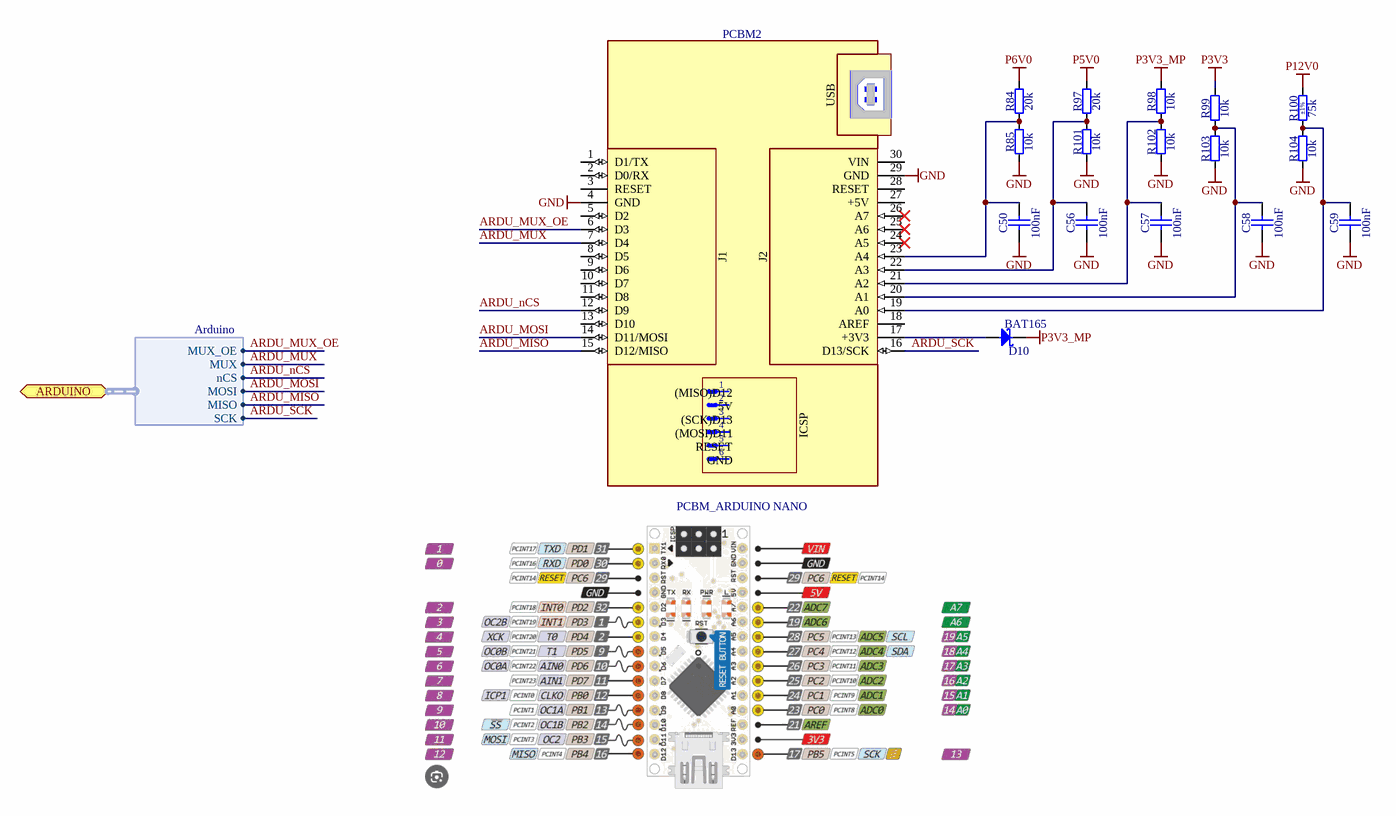
[diagram p3: ARDUINO.SchDoc]

### Parts
C50  100nF  [CAPC1005X55N]
C56  100nF  [CAPC1005X55N]
C57  100nF  [CAPC1005X55N]
C58  100nF  [CAPC1005X55N]
C59  100nF  [CAPC1005X55N]
D10  BAT165  [SOD2512X110N]
PCBM2  PCBM_ARDUINO NANO  [PCBM_ARDUINO NANO_a]
R84  20k  [RESC1608X55N]
R85  10k  [RESC1005X40N]
R97  20k  [RESC1608X55N]
R98  10k  [RESC1005X40N]
R99  10k  [RESC1005X40N]
R100  75k  Tolerance: ±1%  [RESC1608X55N]
R101  10k  [RESC1005X40N]
R102  10k  [RESC1005X40N]
R103  10k  [RESC1005X40N]
R104  10k  [RESC1005X40N]

### Ports
ARDUINO (bidir, harness Arduino)

### Harnesses
Arduino: nCS, MOSI, MISO, SCK, MUX_OE, MUX

### Nets
GND: C50.1 C56.1 C57.1 C58.1 C59.1 PCBM2.4(GND) PCBM2.29(GND) R85.1 R101.1 R102.1 R103.1 R104.1
P3V3: R99.2
P3V3_MP: D10.1(C) R98.2
P5V0: R97.2
P6V0: R84.2
P12V0: R100.2
ARDU_MISO: PCBM2.15(D12/MISO) ; port ARDUINO.MISO
ARDU_MOSI: PCBM2.14(D11/MOSI) ; port ARDUINO.MOSI
ARDU_MUX: PCBM2.7(D4) ; port ARDUINO.MUX
ARDU_MUX_OE: PCBM2.6(D3) ; port ARDUINO.MUX_OE
ARDU_nCS: PCBM2.12(D9) ; port ARDUINO.nCS
ARDU_SCK: PCBM2.16(D13/SCK) ; port ARDUINO.SCK
NetC50_2: C50.2 PCBM2.23(A4) R84.1 R85.2
NetC56_2: C56.2 PCBM2.22(A3) R97.1 R101.2
NetC57_2: C57.2 PCBM2.21(A2) R98.1 R102.2
NetC58_2: C58.2 PCBM2.20(A1) R99.1 R103.2
NetC59_2: C59.2 PCBM2.19(A0) R100.1 R104.2
NetD10_2: D10.2(A) PCBM2.17(+3V3)

Not connected (* = marked no-connect by the designer): PCBM2 1(D1/TX) 2(D0/RX) 3(RESET) 5(D2) 8(D5) 9(D6) 10(D7) 11(D8) 13(D10) 18(AREF) 24(A5)* 25(A6)* 26(A7)* 27(+5V) 28(RESET) 30(VIN)

### Notes on the sheet
- Project/Equipment
- Document
- Designer
- Drawn by
- Check.by
- Copyright WUT ISE 2020.
  This documentation describes Open Hardware and is licensed under the CERN OHL v.1.2. You may redistribute and modify this documentation under the terms of the CERN OHL v.1.2. (http://ohwr.org/CERNOHL). This documentation is distributed WITHOUT ANY EXPRESS OR IMPLIED WARRANTY, INCLUDING OF MERCHANTABILITY, SATISFACTORY QUALITY AND FITNESS FOR A PARTICULAR PURPOSE. Please see the CERN OHL v.1.2 for applicable conditions.
- Contact
- File
- Last Mod.
- Print Date
- Sheet
- Size
- A3
- of
- Rev
- (in symbol PCBM_ARDUINO NANO_a) USB; J1; J2; (MISO)D12; 5V; (SCK)D13; ICSP; (MOSI)D11

### Library data of the parts
C50 C56-C59 = CC0402_100NF_16V_10%_X5R: as C37 on sheet DAC_TLV5637; Part Number: CC0402_100NF_16V_10%_X5R; Component Kind: Standard; Component Type: Standard; Pin Count: 2; Value: 100nF; Status: None; Manufacturer Part Number: CC0402_100NF_16V_10%_X5R; Case: 0402; Mounted: Yes; Socket: No; SMD: Yes; Sense: No; Manufacturer1 Example: MURATA; Manufacturer1 ComponentHeight: 0.55mm; HelpURL: \\cern.ch\dfs\Applications\Altium\Datasheets\CC0402_X5R_MURATA_GRM.pdf; Author: CERN DEM JLC; CreateDate: 10/12/2013; LatestRevisionDate: 10/12/2013
D10 = BAT165: Schottky Diode; Part Description: Medium Power AF Schottky Diode; Manufacturer: INFINEON; Voltage: 40V; Power: 750mA; PressFit: No; Bonding: No; Part Number: BAT165; Component Kind: Standard; Component Type: Standard; Device: BAT165; PackageDescription: Small Outline Diode (SOD-323), 1.70mm W X 1.25mm L X 1.10mm H body,  IPC Medium Density; Manufacturer Part Number: BAT165; Pin Count: 2; Case: SOD-323; Mounted: Yes; Socket: No; SMD: Yes; Sense: No; ComponentHeight: 1.1mm; HelpURL: \\cern.ch\dfs\Applications\Altium\Datasheets\BAT165.pdf; Author: CERN DEM JLC; CreateDate: 12.11.2014; LatestRevisionDate: 12.11.2014
PCBM2 = PCBM_ARDUINO NANO_a: Arduino NANO Printed Circuit Board Module; PressFit: No; Sense Comment: Non-washable; Bonding: No; Part Number: PCBM_ARDUINO NANO_a; Component Kind: Standard; Component Type: Standard; Device: PCBM_ARDUINO NANO; PackageDescription: Microcontroller Board Arduino NANO; Part Description: Arduino NANO Printed Circuit Board Module; Manufacturer: ARDUINO; Manufacturer Part Number: ARDUINO NANO; Pin Count: 0; Mounted: Yes; Socket: No; SMD: No; Sense: Yes; ComponentHeight: 12.6mm; Author: CERN DEM HF; HelpURL: \\cern.ch\dfs\Applications\Altium\Datasheets\PCBM_ARDUINO NANO.pdf; CreateDate: 05.10.2022; LatestRevisionDate: 05.10.2022
R84 R97 = R0603_20K_1%_0.1W_100PPM: Resistor - 1%; Part Description: General Purpose Thick Film Chip Resistor; Manufacturer: GENERIC; Manufacturer1 Part Number: NRC06F2002TRF; Power: 0.1W; TC: ±100ppm/°C; PressFit: No; Part Number: R0603_20K_1%_0.1W_100PPM; Component Kind: Standard; Component Type: Standard; Pin Count: 2; Value: 20k; Status: Preferred; Tolerance: ±1%; Manufacturer Part Number: R0603_20K_1%_0.1W_100PPM; Case: 0603; Mounted: Yes; Sense: No; Socket: No; SMD: Yes; Manufacturer1 Example: NIC COMPONENT; Manufacturer1 ComponentHeight: 0.55mm; HelpURL: \\cern.ch\dfs\Applications\Altium\Datasheets\R0603_NIC_NRC.pdf; Author: CERN DEM JLC; CreateDate: 03/12/2007; LatestRevisionDate: 13/03/2008
R85 R98 R99 R101-R104 = R0402_10K_1%_0.0625W_100PPM: as R115 on sheet TOP; Part Number: R0402_10K_1%_0.0625W_100PPM; Component Kind: Standard; Component Type: Standard; Pin Count: 2; Value: 10k; Status: Not Recommended; Power: 0.0625W; Tolerance: ±1%; Manufacturer Part Number: R0402_10K_1%_0.0625W_100PPM; Case: 0402; Mounted: Yes; Sense: No; Socket: No; SMD: Yes; Manufacturer1 Example: YAGEO PHYCOMP; Manufacturer1 ComponentHeight: 0.4mm; HelpURL: \\cern.ch\dfs\Applications\Altium\Datasheets\R0402_Phycomp_RC0402.pdf; Author: CERN DEM JLC; CreateDate: 03/12/2007; LatestRevisionDate: 17/10/2012
R100 = R0603_75K_1%_0.1W_100PPM: Resistor - 1%; Part Description: General Purpose Thick Film Chip Resistor; Manufacturer: GENERIC; Manufacturer1 Part Number: NRC06F7502TRF; Power: 0.1W; TC: ±100ppm/°C; PressFit: No; Part Number: R0603_75K_1%_0.1W_100PPM; Component Kind: Standard; Component Type: Standard; Pin Count: 2; Value: 75k; Status: Preferred; Manufacturer Part Number: R0603_75K_1%_0.1W_100PPM; Case: 0603; Mounted: Yes; Sense: No; Socket: No; SMD: Yes; Manufacturer1 Example: NIC COMPONENT; Manufacturer1 ComponentHeight: 0.55mm; HelpURL: \\cern.ch\dfs\Applications\Altium\Datasheets\R0603_NIC_NRC.pdf; Author: CERN DEM JLC; CreateDate: 03.12.2007; LatestRevisionDate: 13.03.2008